# Altium project Maj_Pen.PrjPcb
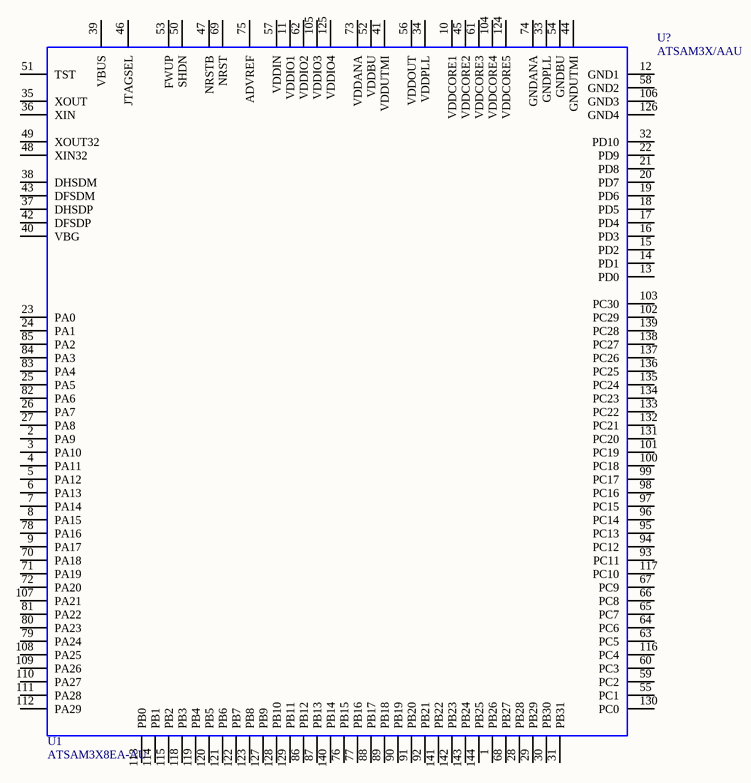
[diagram p0: Maj_Pen.SchDoc]
1 sheet, 1 parts. Net scope: global (net labels, ports and power ports of the same name join across sheets).
Board file: Maj_Pen.PcbDoc

## Sheet Maj_Pen.SchDoc
size A

### Parts
U?  ATSAM3X/AAU  [LQFP144]

### Nets

Not connected (* = marked no-connect by the designer): U? 1(PB26) 2(PA9) 3(PA10) 4(PA11) 5(PA12) 6(PA13) 7(PA14) 8(PA15) 9(PA17) 10(VDDCORE1) 11(VDDIO1) 12(GND1) 13(PD0) 14(PD1) 15(PD2) 16(PD3) 17(PD4) 18(PD5) 19(PD6) 20(PD7) 21(PD8) 22(PD9) 23(PA0) 24(PA1) 25(PA5) 26(PA7) 27(PA8) 28(PB28) 29(PB29) 30(PB30) 31(PB31) 32(PD10) 33(GNDPLL) 34(VDDPLL) 35(XOUT) 36(XIN) 37(DHSDP) 38(DHSDM) 39(VBUS) 40(VBG) 41(VDDUTMI) 42(DFSDP) 43(DFSDM) 44(GNDUTMI) 45(VDDCORE2) 46(JTAGSEL) 47(NRSTB) 48(XIN32) 49(XOUT32) 50(SHDN) 51(TST) 52(VDDBU) 53(FWUP) 54(GNDBU) 55(PC1) 56(VDDOUT) 57(VDDIN) 58(GND2) 59(PC2) 60(PC3) 61(VDDCORE3) 62(VDDIO2) 63(PC5) 64(PC6) 65(PC7) 66(PC8) 67(PC9) 68(PB27) 69(NRST) 70(PA18) 71(PA19) 72(PA20) 73(VDDANA) 74(GNDANA) 75(ADVREF) 76(PB15) 77(PB16) 78(PA16) 79(PA24) 80(PA23) 81(PA22) 82(PA6) 83(PA4) 84(PA3) 85(PA2) 86(PB12) 87(PB13) 88(PB17) 89(PB18) 90(PB19) 91(PB20) 92(PB21) 93(PC11) 94(PC12) 95(PC13) 96(PC14) 97(PC15) 98(PC16) 99(PC17) 100(PC18) 101(PC19) 102(PC29) 103(PC30) 104(VDDCORE4) 105(VDDIO3) 106(GND3) 107(PA21) 108(PA25) 109(PA26) 110(PA27) 111(PA28) 112(PA29) 113(PB0) 114(PB1) 115(PB2) 116(PC4) 117(PC10) 118(PB3) 119(PB4) 120(PB5) 121(PB6) 122(PB7) 123(PB8) 124(VDDCORE5) 125(VDDIO4) 126(GND4) 127(PB9) 128(PB10) 129(PB11) 130(PC0) 131(PC20) 132(PC21) 133(PC22) 134(PC23) 135(PC24) 136(PC25) 137(PC26) 138(PC27) 139(PC28) 140(PB14) 141(PB22) 142(PB23) 143(PB24) 144(PB25)

### Notes on the sheet
- (in symbol ATSAM3X/AAU) U1; ATSAM3X8EA-AU